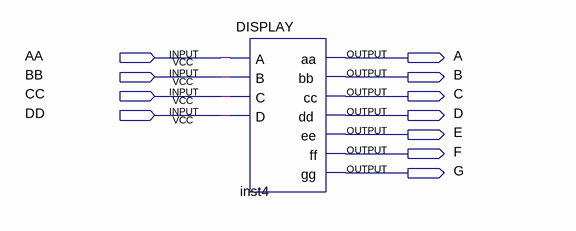
[diagram p0: schematic sheet]
// Quartus schematic EJEMPLO.bdf as structural Verilog: 1 symbols, 11 pins
module EJEMPLO (
  input  AA,
  input  BB,
  input  CC,
  input  DD,
  output A,
  output B,
  output C,
  output D,
  output E,
  output F,
  output G
);

  DISPLAY inst4 (.A(AA), .B(BB), .C(CC), .D(DD), .aa(A), .bb(B), .cc(C), .dd(D), .ee(E), .ff(F), .gg(G));
endmodule
